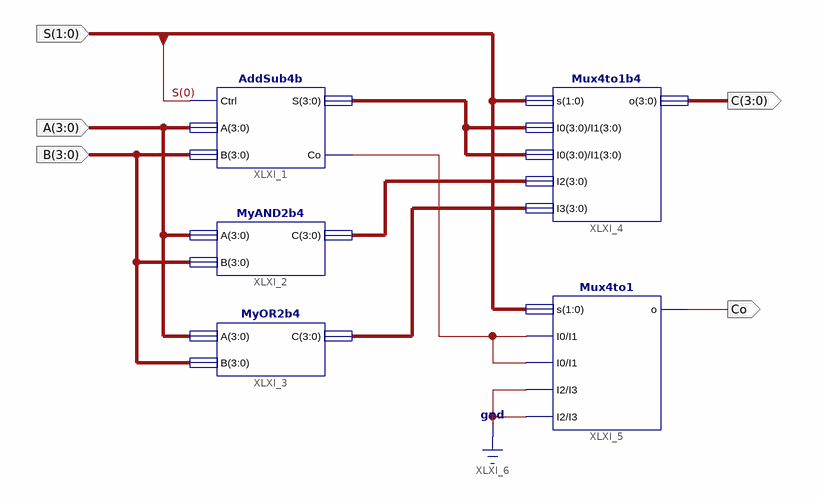
[diagram p0: schematic sheet 1]
// Xilinx ISE schematic ALUb4.sch (kintex7) as structural Verilog: 5 symbols, 5 ports
module ALUb4 (
  input  [3:0] A,
  input  [3:0] B,
  input  [1:0] S,
  output Co,
  output [3:0] C
);

  wire XLXN_33;
  wire [3:0] XLXN_29, XLXN_42, XLXN_43;

  AddSub4b XLXI_1 (.A(A), .B(B), .Ctrl(S[0]), .S(XLXN_29), .Co(XLXN_33));
  MyAND2b4 XLXI_2 (.A(A), .B(B), .C(XLXN_42));
  MyOR2b4 XLXI_3 (.A(A), .B(B), .C(XLXN_43));
  Mux4to1b4 XLXI_4 (.I0(XLXN_29), .I1(XLXN_29), .I2(XLXN_42), .I3(XLXN_43), .o(C), .s(S));
  Mux4to1 XLXI_5 (.I0(XLXN_33), .I1(XLXN_33), .I2(1'b0), .I3(1'b0), .o(Co), .s(S));
endmodule
